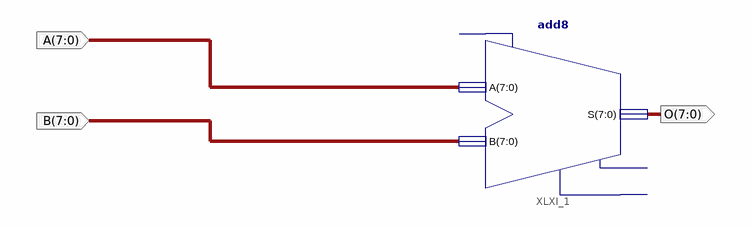
[diagram p0: schematic sheet 1]
// Xilinx ISE schematic ADD7.sch (spartan6) as structural Verilog: 1 symbols, 3 ports
module ADD7 (
  input  [7:0] A,
  input  [7:0] B,
  output [7:0] O
);

  add8 XLXI_1 (.A(A), .B(B), .S(O));  // open: CI, CO, OFL
endmodule
